# Altium schematic sheet Registers.SCHDOC
size A4; DocumentNumber: 3; SheetNumber: 3; SheetTotal: 6
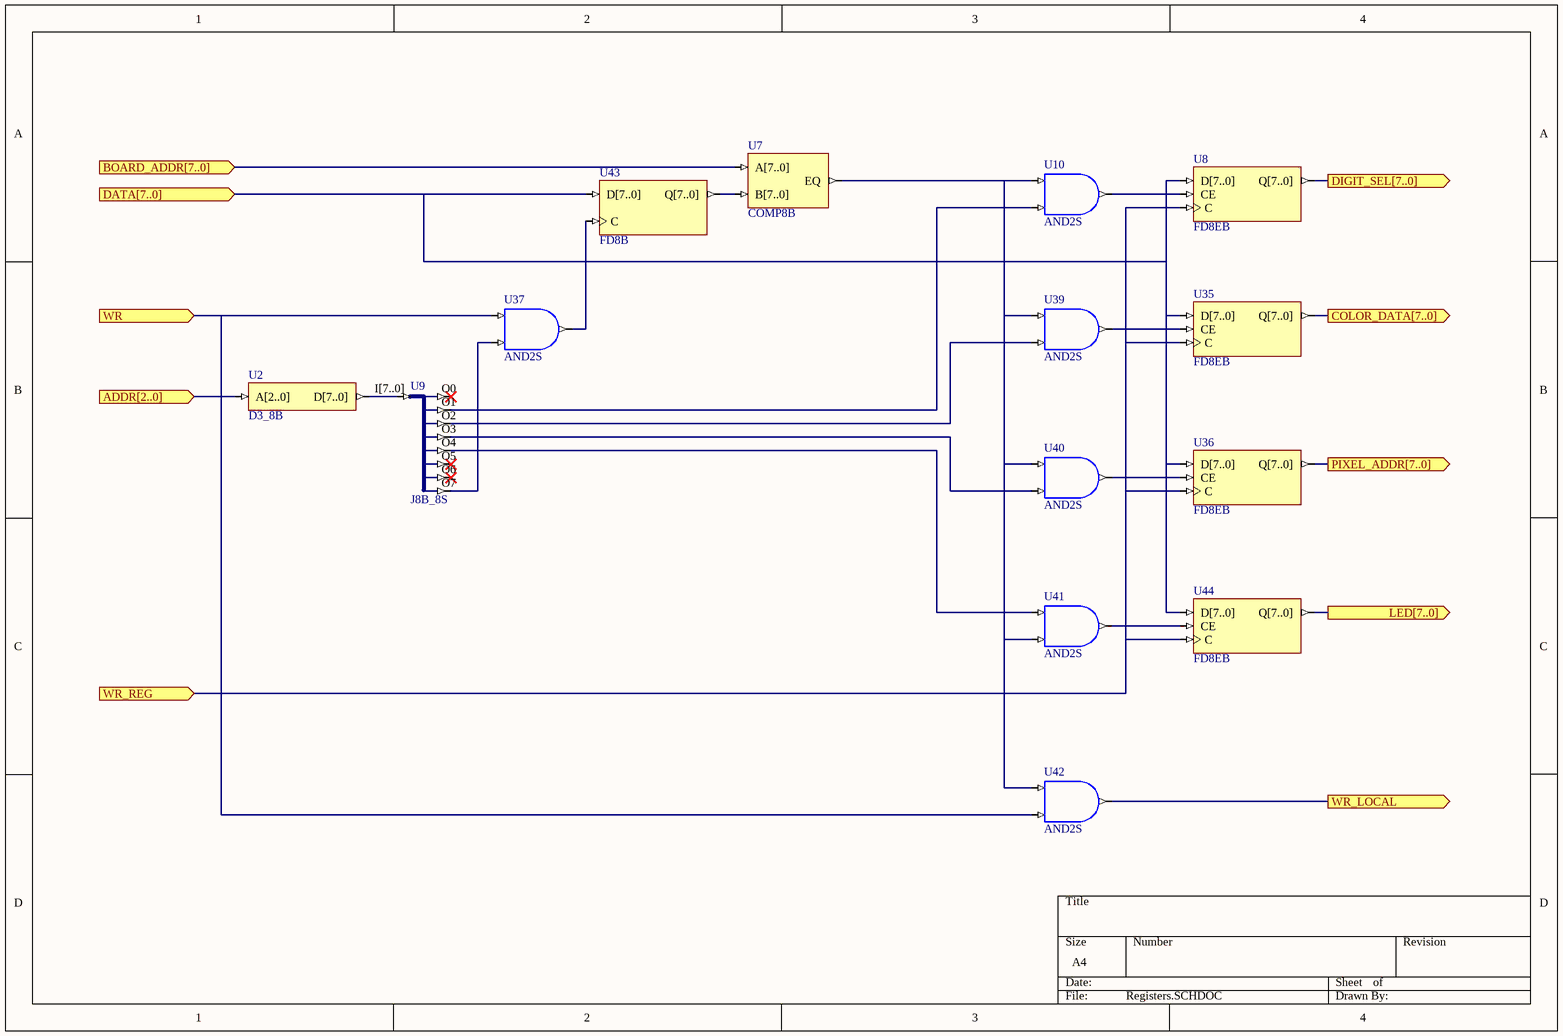
[diagram p0: Registers.SCHDOC]

## Parts
U2  D3_8B
U7  COMP8B
U8  FD8EB
U9  J8B_8S
U10  AND2S
U35  FD8EB
U36  FD8EB
U37  AND2S
U39  AND2S
U40  AND2S
U41  AND2S
U42  AND2S
U43  FD8B
U44  FD8EB

## Ports
ADDR[2..0] (in), BOARD_ADDR[7..0] (in), COLOR_DATA[7..0] (out), DATA[7..0] (in), DIGIT_SEL[7..0] (out), LED[7..0] (out), PIXEL_ADDR[7..0] (out), WR (in), WR_LOCAL (out), WR_REG (in)

## Nets
ADDR[2..0]: U2.A[2..0] ; port ADDR[2..0]
BOARD_ADDR[7..0]: U7.A[7..0] ; port BOARD_ADDR[7..0]
COLOR_DATA[7..0]: U35.Q[7..0] ; port COLOR_DATA[7..0]
DATA[7..0]: U8.D[7..0] U35.D[7..0] U36.D[7..0] U43.D[7..0] U44.D[7..0] ; port DATA[7..0]
DIGIT_SEL[7..0]: U8.Q[7..0] ; port DIGIT_SEL[7..0]
LED[7..0]: U44.Q[7..0] ; port LED[7..0]
PIXEL_ADDR[7..0]: U36.Q[7..0] ; port PIXEL_ADDR[7..0]
WR: U37.I0 U42.I1 ; port WR
WR_LOCAL: U42.O ; port WR_LOCAL
WR_REG: U8.C U35.C U36.C U44.C ; port WR_REG
NetU2_D[7..0]: U2.D[7..0] U9.I[7..0]
NetU7_B[7..0]: U7.B[7..0] U43.Q[7..0]
NetU7_EQ: U7.EQ U10.I0 U39.I0 U40.I0 U41.I1 U42.I0
NetU8_CE: U8.CE U10.O
NetU9_O1: U9.O1 U10.I1
NetU9_O2: U9.O2 U39.I1
NetU9_O3: U9.O3 U40.I1
NetU9_O4: U9.O4 U41.I0
NetU9_O7: U9.O7 U37.I1
NetU35_CE: U35.CE U39.O
NetU36_CE: U36.CE U40.O
NetU37_O: U37.O U43.C
NetU41_O: U41.O U44.CE

Not connected (* = marked no-connect by the designer): U9 O0* O5* O6*

## Library data of the parts
U2 = D3_8B: Binary 3- to 8-Bit Decoder, Bus Version; ArchiveName: GENERIC; Published: 18-Nov-2003; Publisher: Altium Limited; Core Revision: 1.00.00
U7 = COMP8B: 8-Bit Identity Comparator, Bus Version; Xilinx Equivalent: COMP8; ArchiveName: GENERIC; Published: 18-Nov-2003; Publisher: Altium Limited; Core Revision: 1.00.00
U8 U35 U36 U44 = FD8EB: 8-Bit D Flip-Flop with Clock Enable, Bus Version; ArchiveName: GENERIC; Published: 18-Dec-2003; Publisher: Altium Limited; Core Revision: 1.00.00
U9 = J8B_8S: 8-Bit input bus to 8 single pin outputs; ArchiveName: GENERIC; Published: 18-Nov-2003; Publisher: Altium Limited; Core Revision: 1.00.00
U10 U37 U39-U42 = AND2S: 2-Input AND Gate, Single Pin Version; Xilinx Equivalent: AND2; ArchiveName: GENERIC; Published: 18-Nov-2003; Publisher: Altium Limited; Core Revision: 1.00.00
U43 = FD8B: 8-Bit D-Type Flip-Flop, Bus Version; Xilinx Equivalent: FD8; ArchiveName: GENERIC; Published: 18-Nov-2003; Publisher: Altium Limited; Core Revision: 1.00.00